# EasyEDA Pro project macro_fader.eprj

# Board macro_fader
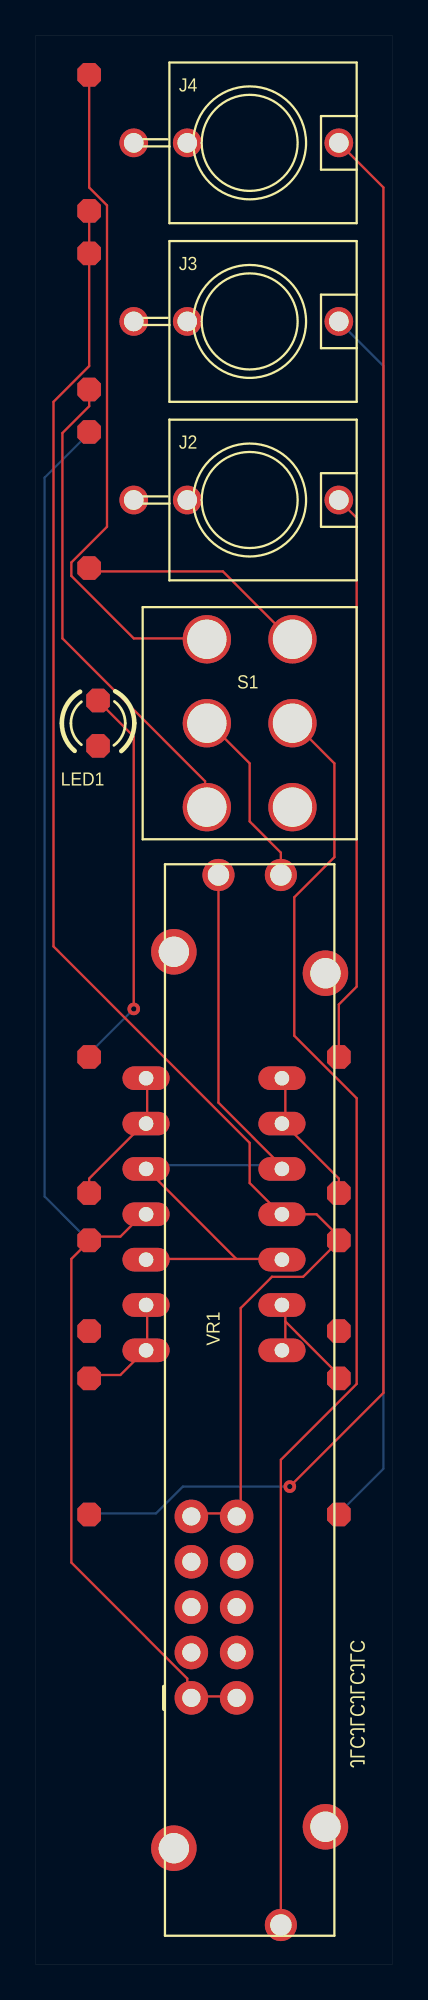
[diagram p0: board, top side]
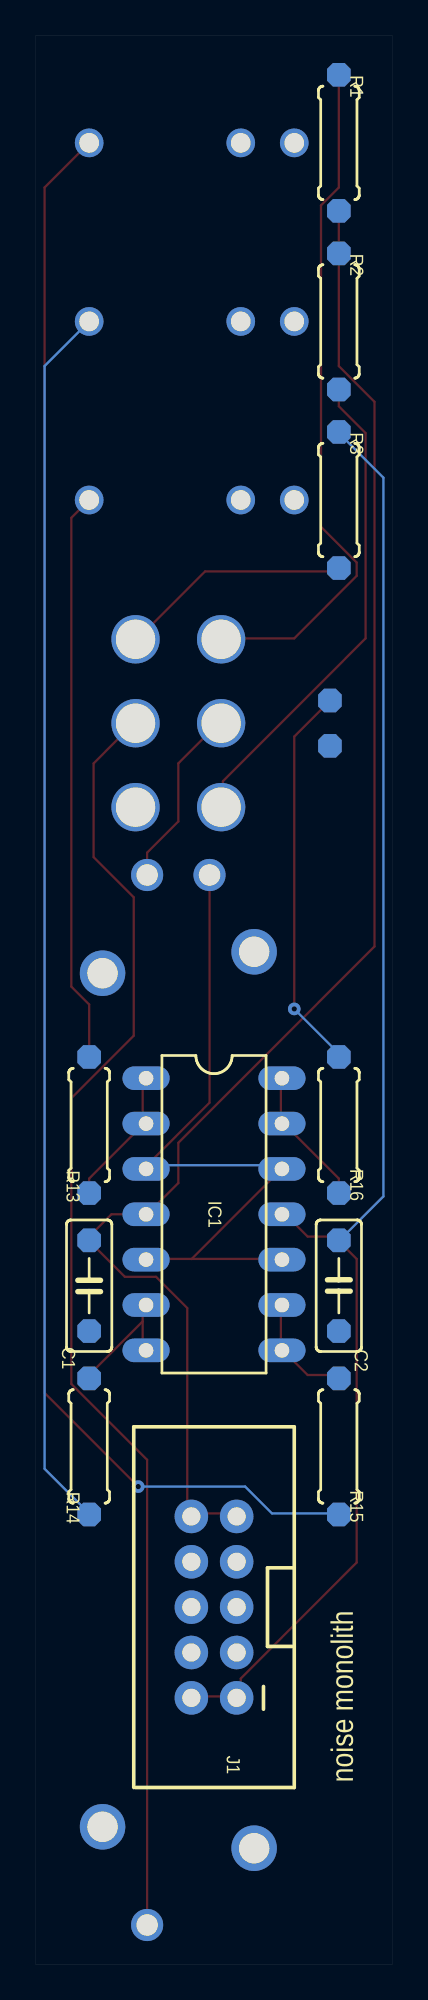
[diagram p1: board, bottom side, seen from below]

Outline 20 x 108 mm; copper layers: Top Layer, Bottom Layer. Coordinates in mm from the lower left corner of the outline.
Outline path: 0,108 0,0 20,0 20,108 0,108
Stack: Top Layer 0.035mm / Dielectric1 1.51mm FR4 er 4.5 / Bottom Layer 0.035mm

## Design rules (mm)
spacing safeClearance (default): track to track 0.127, other pairs 0 to 0.2
track width trackWidth (default): min 0.003, default 0.003, max 2.54
differential pair differentialPair (default): width min 0.127, default 0.254, max 2.54; gap min 0.152, default 0.152
via viaSize (default): diameter min 0, default 0, max 2.6; hole min 0, default 0, max 2
pour ie1 uses CopperRegion

## Placement (name value [footprint] x y rotation side)
C1  0.1uF  [C050-025X075]  17 38 270 bottom
C2  0.1uF  [C050-025X075]  3 38 90 bottom
IC1  TL074P  [DIL14]  10 42 270 bottom
J1  -  [2X5-SHROUDED]  10 20 0 bottom
J2  -  [WQP-PJ301M-12_JACK]  12 82 270 top
J3  -  [WQP-PJ301M-12_JACK]  12 92 270 top
J4  -  [WQP-PJ301M-12_JACK]  12 102 270 top
LED1  -  [A-1076_RED-GREEN-LED-3MM]  3.5 69.5 270 top
R1  7k  [0207/7]  3 102 90 bottom
R2  14k  [0207/7]  3 92 270 bottom
R3  7k  [0207/7]  3 82 270 bottom
R13  1k  [0207/7]  17 47 90 bottom
R14  1k  [0207/7]  17 29 270 bottom
R15  1k  [0207/7]  3 29 270 bottom
R16  220  [0207/7]  3 47 90 bottom
S1  -  [A-4568_MINITOGGLESWITCH_DPDT_ON-ON]  12 69.5 0 top
VR1  -  [F4505-N0SC2B10K]  12 61 270 top

## Footprints (pads in the part's own frame, mm; a bottom-side part is the same pattern mirrored in y, then rotated)
2X5-SHROUDED
  round 1.879 hole 1.016: 1(-1.27,5.08) 2(1.27,5.08) 3(-1.27,2.54) 4(1.27,2.54) 5(-1.27,0) 6(1.27,0) 7(-1.27,-2.54) 8(1.27,-2.54) 9(-1.27,-5.08) 10(1.27,-5.08)
0207/7
  custom 1.321x1.321 hole 0.813: 1(-3.81,0) 2(3.81,0)
A-1076_RED-GREEN-LED-3MM
  custom 1.321x1.321 hole 0.813: G(1.27,0) R(-1.27,0)
A-4568_MINITOGGLESWITCH_DPDT_ON-ON
  round 2.708 hole 2.2: 1(-2.4,4.7) 2(-2.4,0) 3(-2.4,-4.7) 4(2.4,4.7) 5(2.4,0) 6(2.4,-4.7)
C050-025X075
  custom 1.321x1.321 hole 0.813: 1(-2.54,0) 2(2.54,0)
DIL14
  oval 1.321x2.642 hole 0.813: 1(-7.62,-3.81) 2(-5.08,-3.81) 3(-2.54,-3.81) 4(0,-3.81) 5(2.54,-3.81) 6(5.08,-3.81) 7(7.62,-3.81) 8(7.62,3.81) 9(5.08,3.81) 10(2.54,3.81) 11(0,3.81) 12(-2.54,3.81) 13(-5.08,3.81) 14(-7.62,3.81)
F4505-N0SC2B10K
  round 1.8 hole 1.2: 1(0,1.75) 2(0,-1.75) 3(58.8,1.75)
  round 2.55 hole 1.7: MH1(5.5,4.25) MH2(4.3,-4.25) MH3(53.3,4.25) MH4(54.5,-4.25)
WQP-PJ301M-12_JACK
  round 1.608 hole 1.1: P$1(0,5) P$2(0,-3.5) P$3(0,-6.5)

## Nets
+12V: C1.1 IC1.4 J1.9 J1.10 R1.1 R2.1
-12V: C2.2 IC1.11 J1.1 J1.2 R3.1
GND: C1.2 C2.1 J1.3 J1.4 J1.5 J1.6 J1.7 J1.8 J2.P$3 J3.P$3 J4.P$3 LED1.G S1.6
FADER_1: IC1.3 IC1.5 IC1.10 IC1.12 VR1.2
N$1: S1.2 VR1.1
N$2: S1.5 VR1.3
N$3: R1.2 S1.1
N$4: IC1.1 IC1.2 R13.1
N$5: R2.2 S1.3
N$6: J2.P$1 R13.2
N$7: R3.2 S1.4
N$9: IC1.6 IC1.7 R14.1
N$10: J3.P$1 R14.2
N$11: IC1.8 IC1.9 R15.1
N$12: J4.P$1 R15.2
N$13: IC1.13 IC1.14 R16.1
N$14: LED1.R R16.2

Pads without a net: J2 P$2; J3 P$2; J4 P$2; VR1 MH1 MH2 MH3 MH4

## Via types
v1: diameter 0.707, hole 0.3, Top Layer to Bottom Layer, 2 vias

## Routing (per net, layer and track width the routed paths; a pad name or vN(x,y) marks a point on that pad's centre or on a via; arc(x,y) is an arc through that point)
+12V: length 88
  Top Layer w0.127: J1.9 8.75,25.25 11.25,25.25 J1.10 11.5,25.25 11.5,36.75 13.25,38.5 15,38.5 17,40.5 C1.1 17,40.75 15.75,42 IC1.4 13.75,42 12,43.75 12,46 1,57 1,87.5 3,89.5 R2.1 R1.1
-12V: length 82.9
  Top Layer w0.127: J1.2 11.25,15 8.75,15 J1.1 8.5,15 8.5,16 2,22.5 2,39.5 3,40.5 C2.2 3,40.75 4.75,40.75 6,42 IC1.11
  Bottom Layer w0.127: R3.1 3,85.75 0.5,83.25 0.5,43 3,40.5 C2.2
FADER_1: length 40.6
  Top Layer w0.127: IC1.12 6.25,44.5 11.25,39.5 ; IC1.5 13.75,39.5 11.25,39.5 ; IC1.10 6.25,39.5 11.25,39.5 ; VR1.2 10.25,48.25 13.75,44.75 IC1.3
  Bottom Layer w0.127: IC1.12 6.25,44.75 13.75,44.75 IC1.3
N$1: length 10.3
  Top Layer w0.127: VR1.1 13.75,62.25 12,64 12,67.25 9.75,69.5 S1.2
N$2: length 72.5
  Top Layer w0.127: VR1.3 13.75,28.25 18,32.5 18,48.5 14.5,52 14.5,59.75 16.75,62 16.75,67.25 14.5,69.5 S1.5
N$3: length 38.4
  Top Layer w0.127: R1.2 3,99.5 4,98.5 4,80.5 2,78.5 2,77.75 5.5,74.25 9.5,74.25 S1.1
N$4: length 8
  Top Layer w0.127: IC1.1 14,49.5 14,47.25 IC1.2 14,47 17,44 R13.1
N$5: length 27.3
  Top Layer w0.127: R2.2 3,87.25 1.5,85.75 1.5,74.25 9.5,66.25 9.5,65 S1.3
N$6: length 32
  Top Layer w0.127: J2.P$1 18,81 18,54.75 17,53.75 R13.2
N$7: length 13.2
  Top Layer w0.127: R3.2 3,78 10.5,78 14.25,74.25 S1.4
N$9: length 7.2
  Top Layer w0.127: 14,36 14,34.5 IC1.7 ; 14,36 14,36.75 IC1.6 ; 14,36 17,33 R14.1
N$10: length 68.9
  Bottom Layer w0.127: R14.2 17,25.25 19.5,27.75 19.5,89.5 J3.P$1
N$11: length 6.5
  Top Layer w0.127: R15.1 3,33 4.75,33 6,34.25 IC1.8 6.25,34.5 6.25,36.75 IC1.9
N$12: length 90.4
  Top Layer w0.127: J4.P$1 19.5,99.5 19.5,32 v1(14.25,26.75)
  Bottom Layer w0.127: v1(14.25,26.75) 8.25,26.75 6.75,25.25 3,25.25 R15.2
N$13: length 7.8
  Top Layer w0.127: R16.1 3,44 6,47 IC1.13 6.25,47.25 6.25,49.5 IC1.14
N$14: length 21.8
  Top Layer w0.127: LED1.R 3.5,70.75 5.5,68.75 v1(5.5,53.5)
  Bottom Layer w0.127: R16.2 3,51 v1(5.5,53.5)

## Copper pours and planes (outline as drawn; the poured copper is in the pictures)
GND on Bottom Layer: 1,1 19,1 19,107 1,107

## Text on the board
Bottom Silkscreen Layer: noise monolith
Top Silkscreen Layer: JLCJLCJLCJLC

# Board PCB2
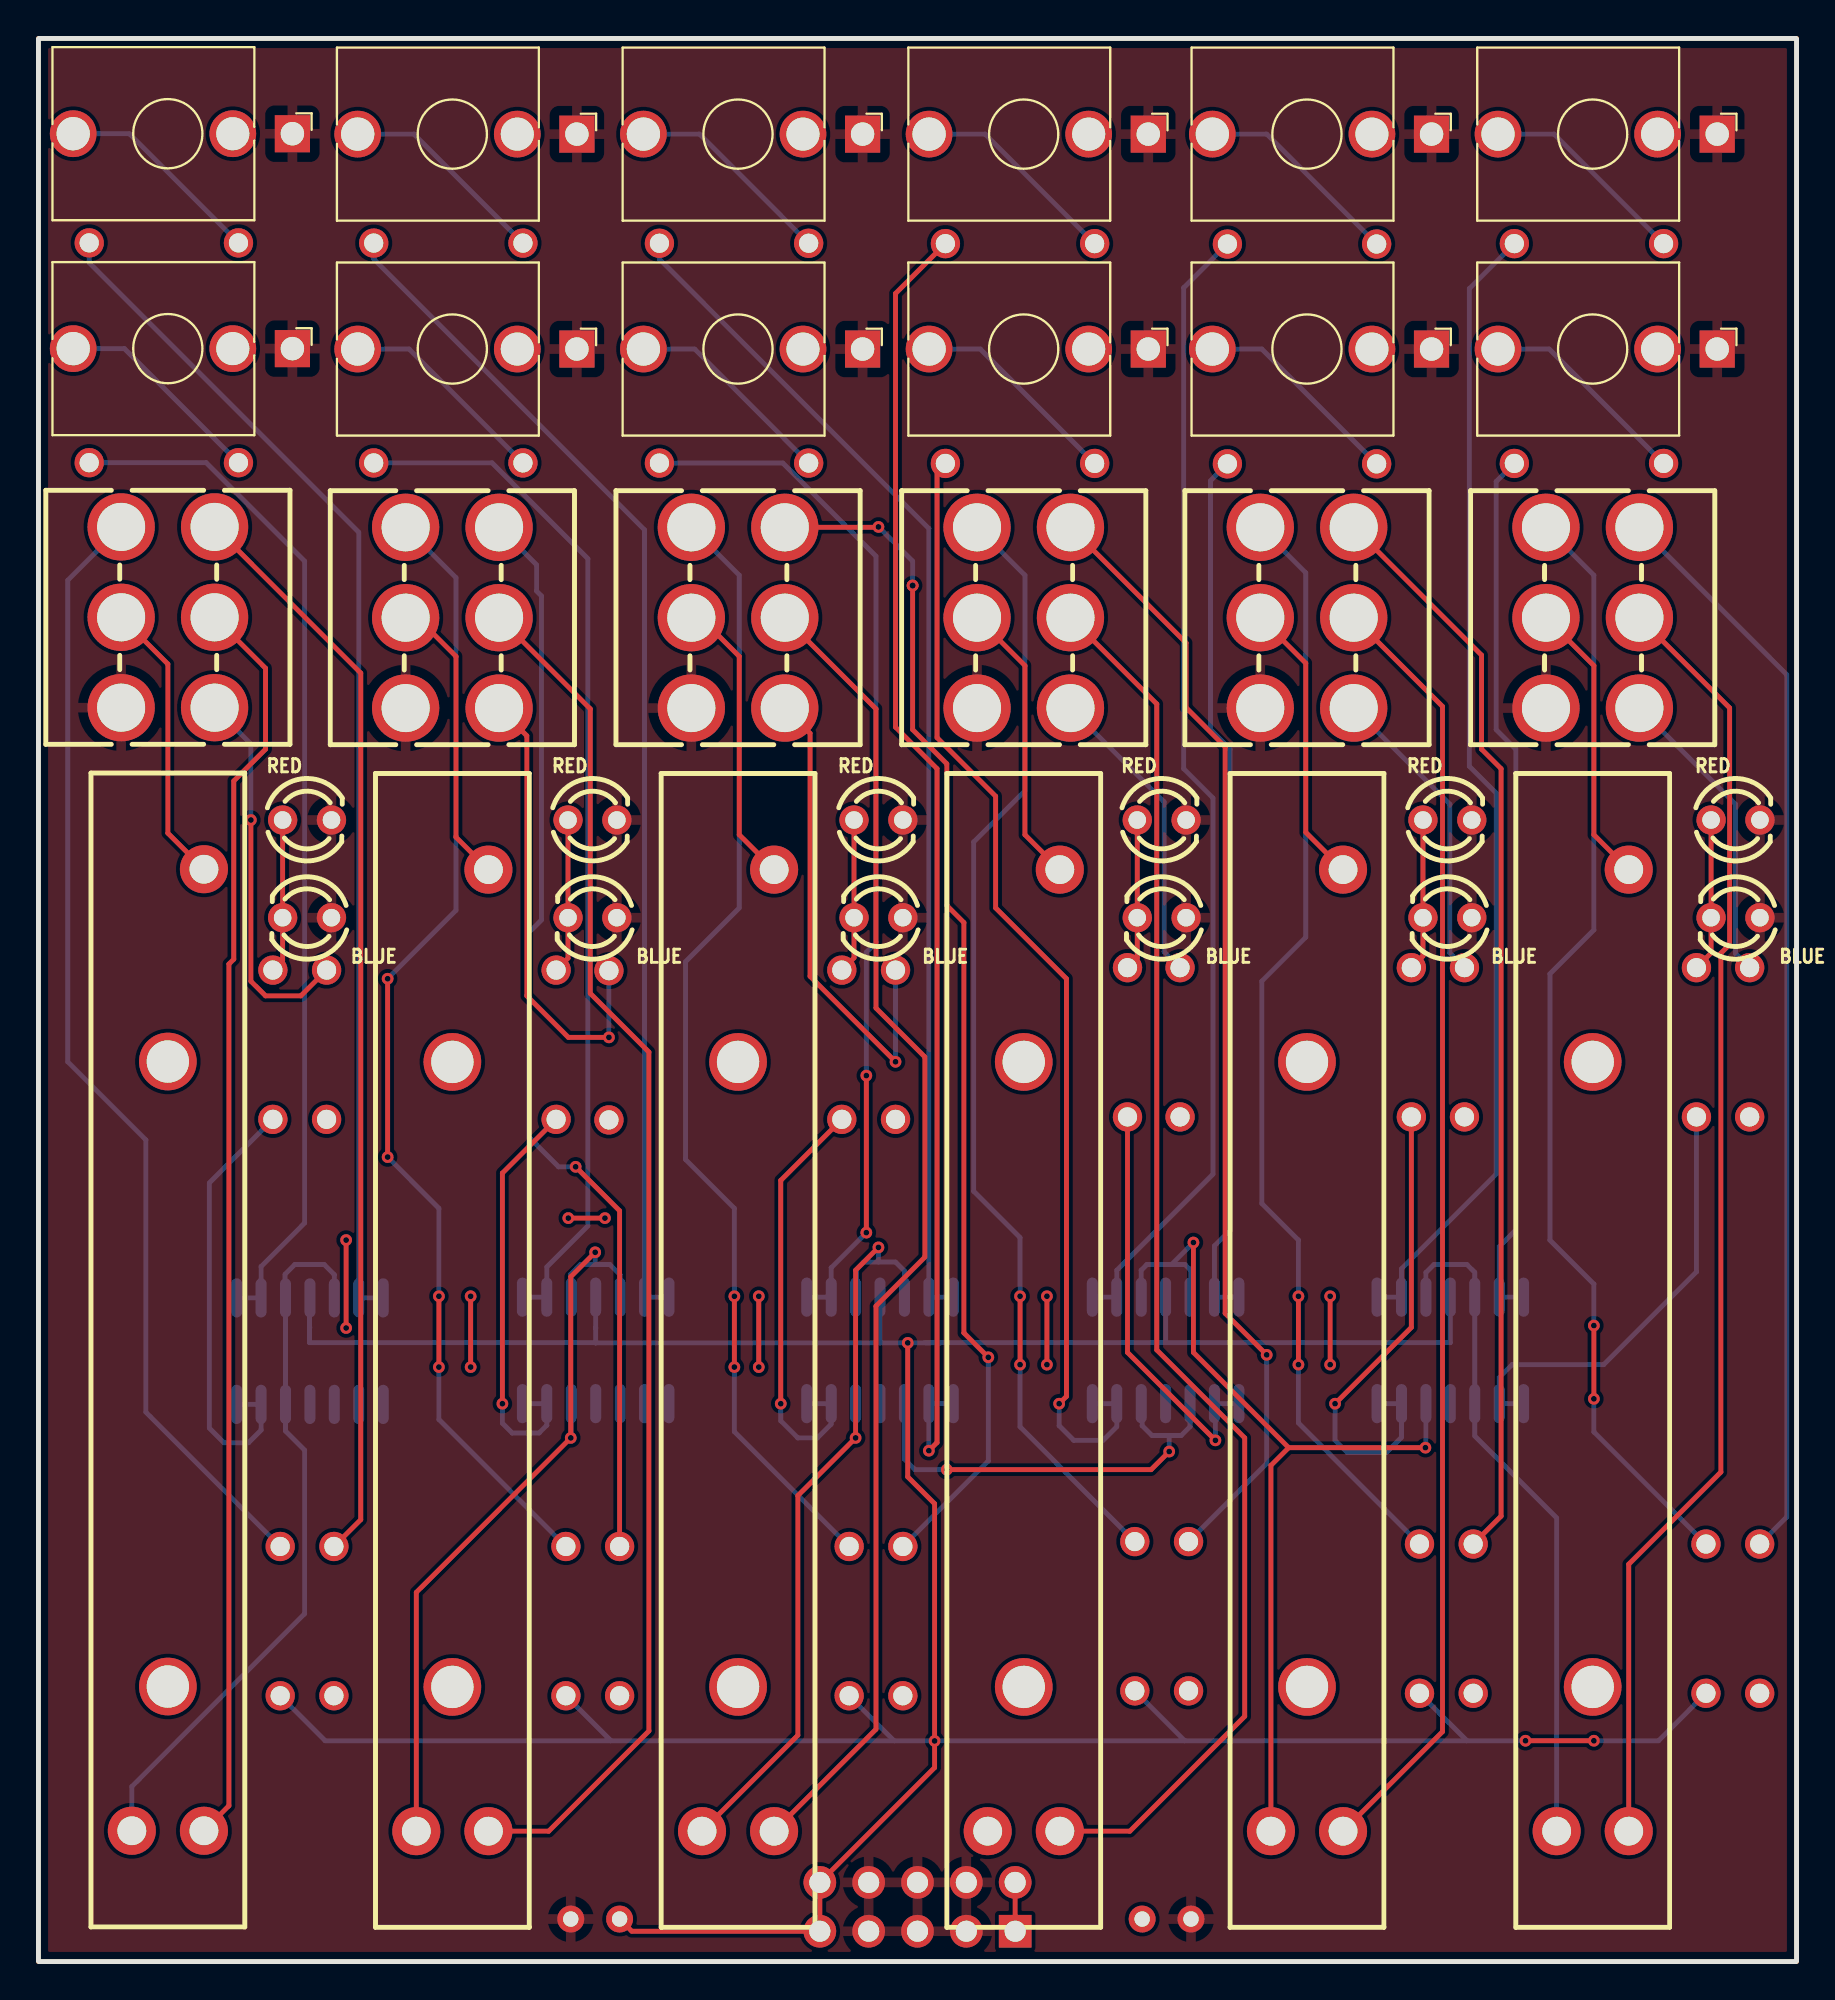
[diagram p2: board, top side]
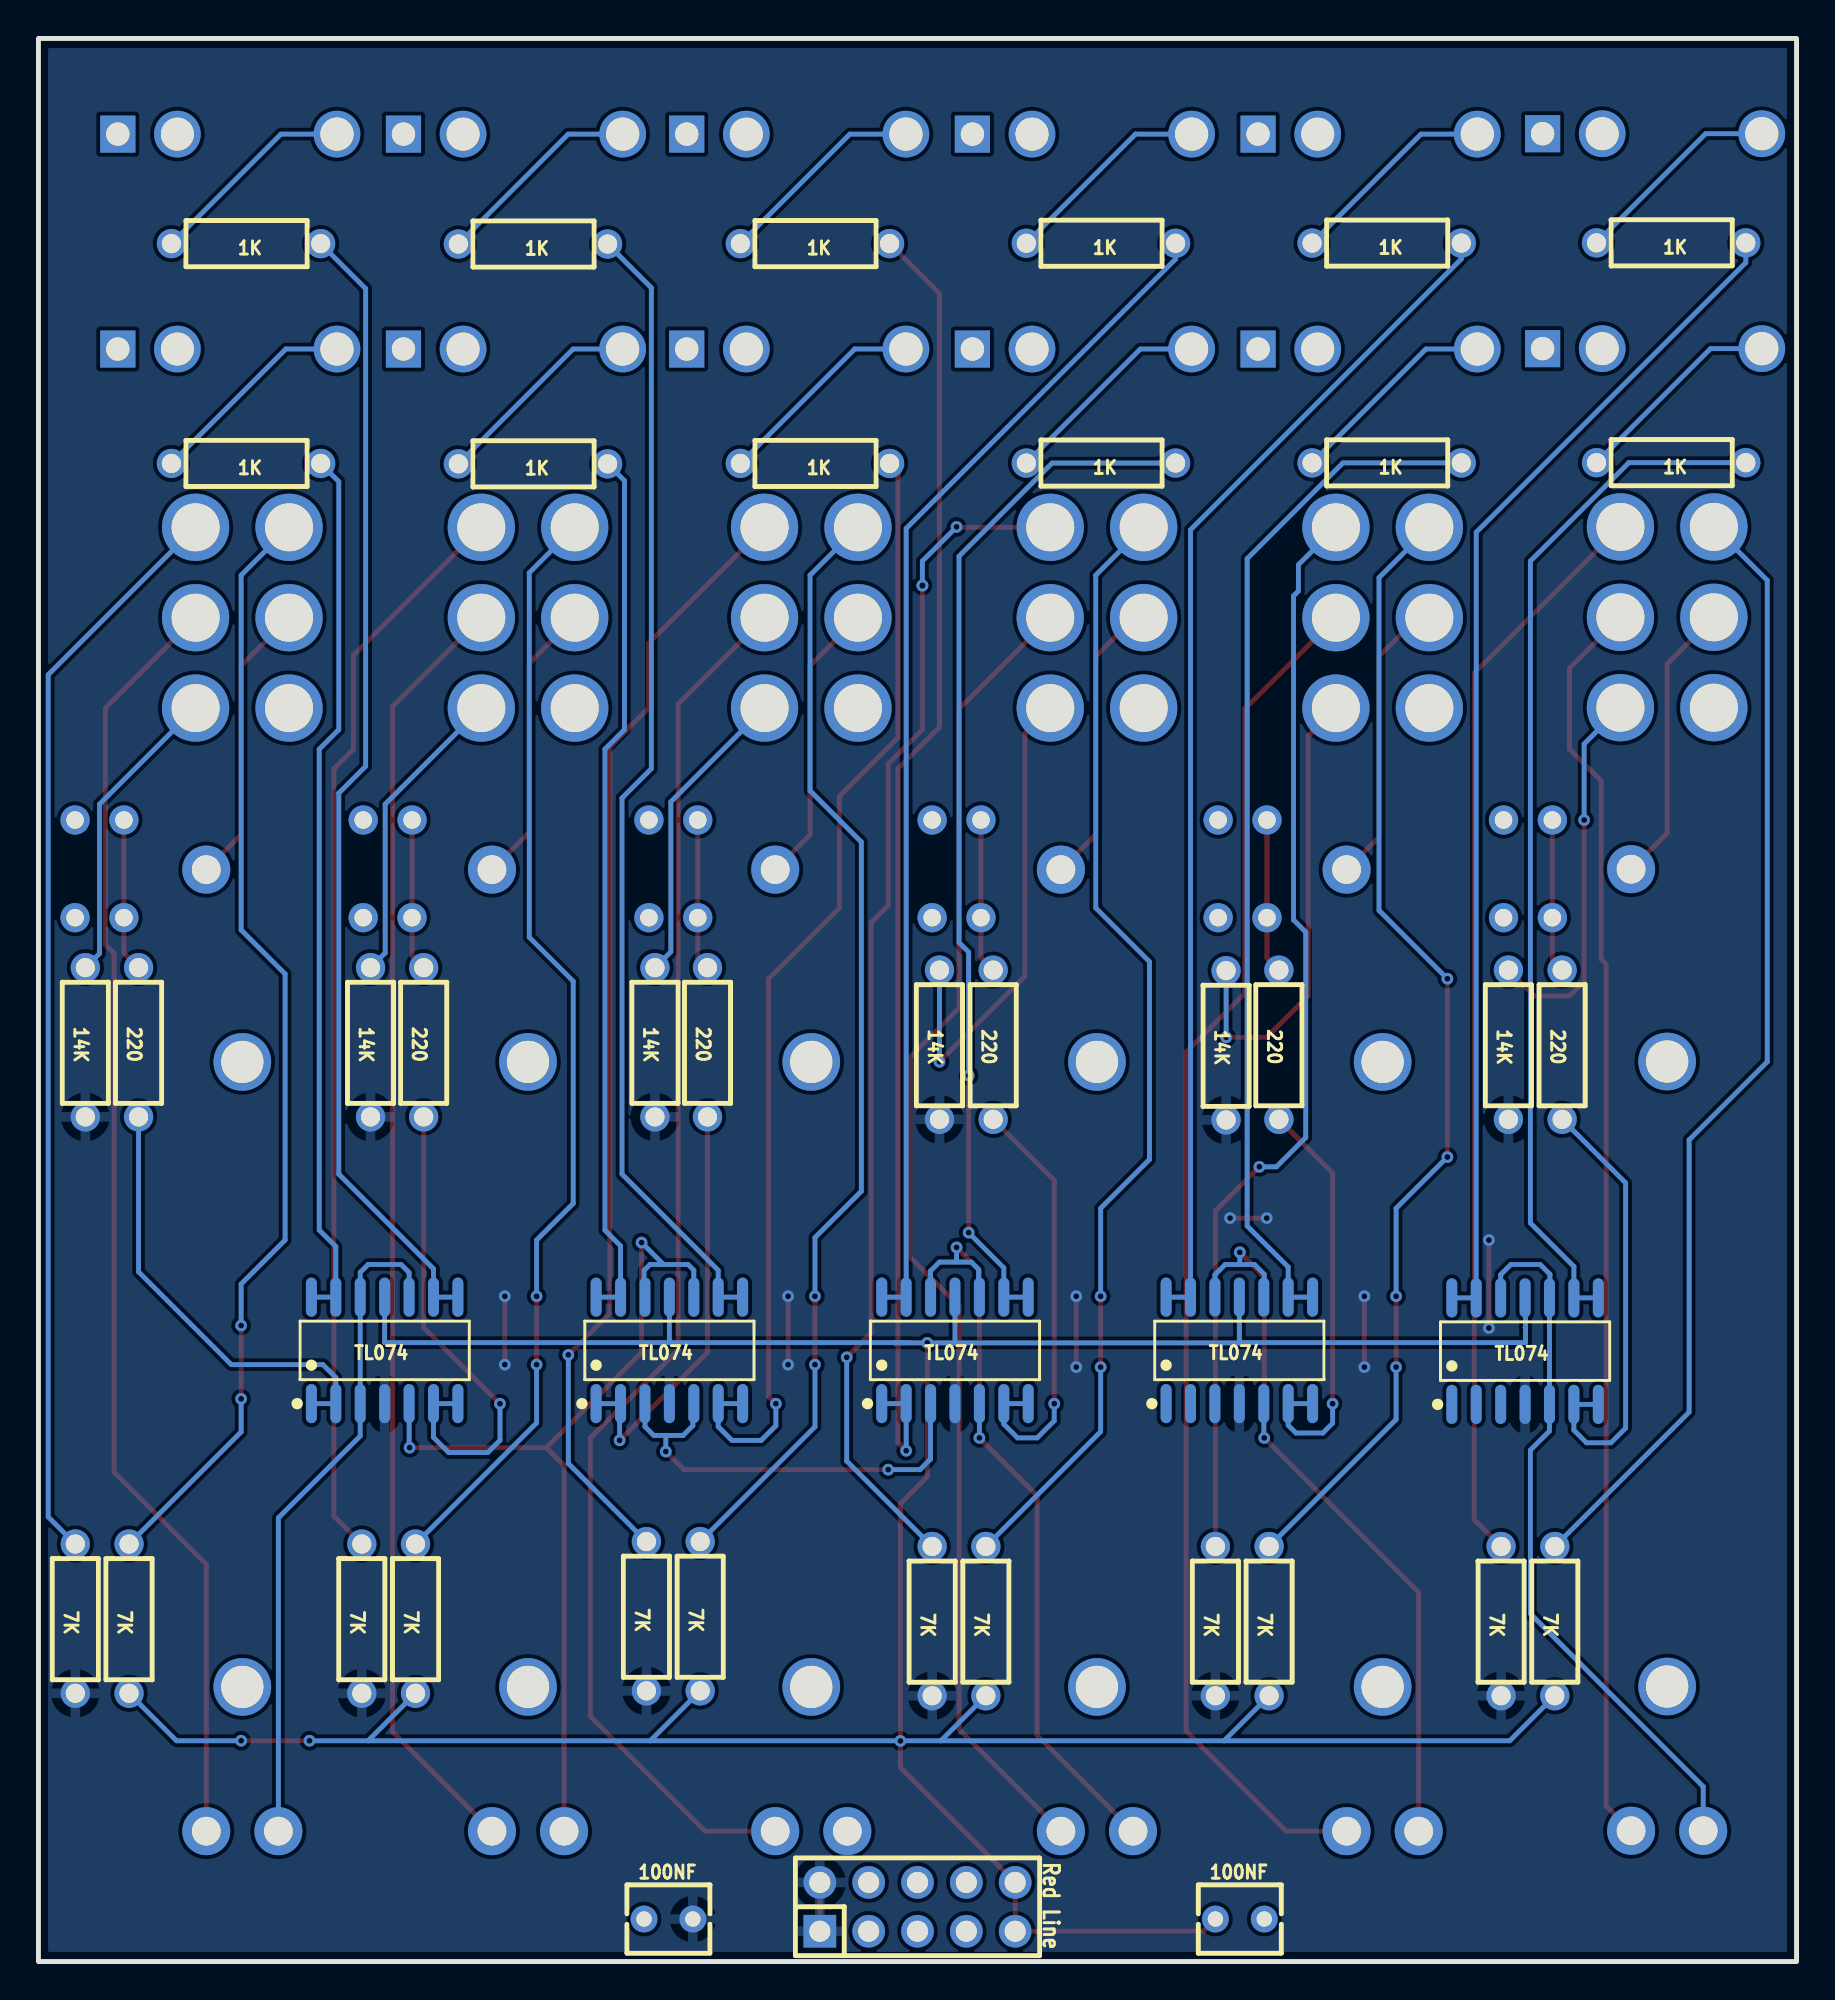
[diagram p3: board, bottom side, seen from below]

Outline 91.44 x 100 mm; copper layers: Top Layer, Bottom Layer. Coordinates in mm from the lower left corner of the outline.
Outline path: rectangle 0,100 91.44,0
Stack: Top Layer 0.035mm / Dielectric1 1.51mm FR4 er 4.5 / Bottom Layer 0.035mm

## Design rules (mm)
template: JLCPCB Capability(Two Layers Board)
spacing copperThickness1oz (default): track to track 0.102, other pairs 0.152 to 0.3
spacing copperThickness2oz: track to track 0.203, other pairs 0.152 to 0.3
track width copperThickness1oz (default): min 0.127, default 0.254, max 2.54
track width copperThickness2oz: min 0.203, default 0.254, max 2.54
differential pair differentialPair (default): width min 0.127, default 0.254, max 2.54; gap min 0.152, default 0.152
via viaSize (default): diameter min 0.5, default 0.61, max 10; hole min 0.3, default 0.305, max 6.3

## Placement (name value [footprint] x y rotation side)
1K  -  [Resistor_Small]  51.05 89.33 180 bottom
1K#2  -  [Resistor_Small]  51.05 77.9 180 bottom
1K#3  -  [Resistor_Small]  65.72 89.31 180 bottom
1K#4  -  [Resistor_Small]  65.72 77.88 180 bottom
1K#5  -  [Resistor_Small]  80.65 89.33 180 bottom
1K#6  -  [Resistor_Small]  80.65 77.9 180 bottom
1K#7  -  [Resistor_Small]  36.18 89.35 180 bottom
1K#8  -  [Resistor_Small]  36.18 77.92 180 bottom
1K#9  -  [Resistor_Small]  21.32 89.36 180 bottom
1K#10  -  [Resistor_Small]  21.32 77.93 180 bottom
1K#11  -  [Resistor_Small]  6.52 89.37 180 bottom
1K#12  -  [Resistor_Small]  6.52 77.94 180 bottom
7K  -  [Resistor_Small]  86.73 17.83 270 bottom
7K#2  -  [Resistor_Small]  71.83 17.83 270 bottom
7K#3  -  [Resistor_Small]  74.62 17.83 270 bottom
7K#4  -  [Resistor_Small]  57.02 17.96 270 bottom
7K#5  -  [Resistor_Small]  59.82 17.96 270 bottom
7K#6  -  [Resistor_Small]  42.16 17.7 270 bottom
7K#7  -  [Resistor_Small]  44.96 17.7 270 bottom
7K#8  -  [Resistor_Small]  27.43 17.7 270 bottom
7K#9  -  [Resistor_Small]  30.23 17.7 270 bottom
7K#10  -  [Resistor_Small]  12.57 17.7 270 bottom
7K#11  -  [Resistor_Small]  15.37 17.7 270 bottom
7K#12  -  [Resistor_Small]  89.52 17.83 270 bottom
14K  -  [Resistor_Small]  74.17 47.8 270 bottom
14K#2  -  [Resistor_Small]  89 47.8 270 bottom
14K#3  -  [Resistor_Small]  59.38 47.8 270 bottom
14K#4  -  [Resistor_Small]  44.58 47.68 270 bottom
14K#5  -  [Resistor_Small]  29.67 47.65 270 bottom
14K#6  -  [Resistor_Small]  14.99 47.68 270 bottom
100NF  -  [CAP-TH_L4.2-W3.5-P2.54-D0.5]  58.67 2.21 180 bottom
100NF#2  -  [CAP-TH_L4.2-W3.5-P2.54-D0.5]  28.96 2.21 180 bottom
220  -  [Resistor_Small]  86.23 47.8 270 bottom
220#2  -  [Resistor_Small]  71.41 47.8 270 bottom
220#3  -  [Resistor_Small]  56.64 47.8 270 bottom
220#4  -  [Resistor_Small]  41.78 47.68 270 bottom
220#5  -  [Resistor_Small]  26.92 47.68 270 bottom
220#6  -  [Resistor_Small]  12.19 47.68 270 bottom
BLUE  -  [LED-TH_BD3.0-P2.54-FD]  13.97 54.28 180 top
BLUE#2  -  [LED-TH_BD3.0-P2.54-FD]  28.81 54.28 180 top
BLUE#3  -  [LED-TH_BD3.0-P2.54-FD]  43.69 54.28 180 top
BLUE#4  -  [LED-TH_BD3.0-P2.54-FD]  58.42 54.28 180 top
BLUE#5  -  [LED-TH_BD3.0-P2.54-FD]  73.28 54.28 180 top
BLUE#6  -  [LED-TH_BD3.0-P2.54-FD]  88.26 54.28 180 top
J2  -  [benjiaomodular:AudioJack_3.5mm]  87.31 83.85 270 top
J2#2  -  [benjiaomodular:AudioJack_3.5mm]  87.31 95.03 270 top
J2#3  -  [benjiaomodular:AudioJack_3.5mm]  13.21 95.05 270 top
J2#4  -  [benjiaomodular:AudioJack_3.5mm]  13.21 83.87 270 top
J2#5  -  [benjiaomodular:AudioJack_3.5mm]  28 83.85 270 top
J2#6  -  [benjiaomodular:AudioJack_3.5mm]  28 95.03 270 top
J2#7  -  [benjiaomodular:AudioJack_3.5mm]  42.86 83.85 270 top
J2#8  -  [benjiaomodular:AudioJack_3.5mm]  42.86 95.03 270 top
J2#9  -  [benjiaomodular:AudioJack_3.5mm]  57.72 83.85 270 top
J2#10  -  [benjiaomodular:AudioJack_3.5mm]  57.72 95.03 270 top
J2#11  -  [benjiaomodular:AudioJack_3.5mm]  72.46 83.85 270 top
J2#12  -  [benjiaomodular:AudioJack_3.5mm]  72.46 95.03 270 top
RED  -  [LED-TH_BD3.0-P2.54-FD]  13.97 59.36 0 top
RED#2  -  [LED-TH_BD3.0-P2.54-FD]  28.81 59.36 0 top
RED#3  -  [LED-TH_BD3.0-P2.54-FD]  43.69 59.36 0 top
RED#4  -  [LED-TH_BD3.0-P2.54-FD]  58.42 59.36 0 top
RED#5  -  [LED-TH_BD3.0-P2.54-FD]  73.28 59.36 0 top
RED#6  -  [LED-TH_BD3.0-P2.54-FD]  88.26 59.36 0 top
SW1  -  [SW-TH_6P-P4.70_MT-0-202-A101-M200-RS-PJ]  80.84 69.88 0 top
SW1#2  -  [SW-TH_6P-P4.70_MT-0-202-A101-M200-RS-PJ]  6.73 69.9 0 top
SW1#3  -  [SW-TH_6P-P4.70_MT-0-202-A101-M200-RS-PJ]  21.53 69.88 0 top
SW1#4  -  [SW-TH_6P-P4.70_MT-0-202-A101-M200-RS-PJ]  36.39 69.88 0 top
SW1#5  -  [SW-TH_6P-P4.70_MT-0-202-A101-M200-RS-PJ]  51.25 69.88 0 top
SW1#6  -  [SW-TH_6P-P4.70_MT-0-202-A101-M200-RS-PJ]  65.98 69.88 0 top
TL074  -  [SOIC-14_L8.7-W3.9-P1.27-LS6.0-BL]  73.43 31.78 180 bottom
TL074#2  -  [SOIC-14_L8.7-W3.9-P1.27-LS6.0-BL]  58.62 31.78 180 bottom
TL074#3  -  [SOIC-14_L8.7-W3.9-P1.27-LS6.0-BL]  28.98 31.78 180 bottom
TL074#4  -  [SOIC-14_L8.7-W3.9-P1.27-LS6.0-BL]  14.12 31.74 180 bottom
TL074#5  -  [SOIC-14_L8.7-W3.9-P1.27-LS6.0-BL]  43.77 31.78 180 bottom
U1  ZX-PZ2.54-2-5PZZ  [HDR-TH_10P-P2.54-V-M-R2-C5-S2.54]  45.72 2.84 180 bottom
U2  -  [RES-ADJ-TH_RS45111A900F]  80.84 31.78 90 top
U2#2  -  [RES-ADJ-TH_RS45111A900F]  21.53 31.78 90 top
U2#3  -  [RES-ADJ-TH_RS45111A900F]  6.73 31.8 90 top
U2#4  -  [RES-ADJ-TH_RS45111A900F]  36.39 31.78 90 top
U2#5  -  [RES-ADJ-TH_RS45111A900F]  51.25 31.78 90 top
U2#6  -  [RES-ADJ-TH_RS45111A900F]  65.98 31.78 90 top

## Footprints (pads in the part's own frame, mm; a bottom-side part is the same pattern mirrored in y, then rotated)
benjiaomodular:AudioJack_3.5mm
  rect 1.93x1.83 hole 1.22: S(0,0)
  round 2.43 hole 1.73: T(0,-11.4)
  round 2.43 hole 1.72: TN(0,-3.1)
CAP-TH_L4.2-W3.5-P2.54-D0.5
  round 1.4 hole 0.8: 1(-1.27,0) 2(1.27,0)
HDR-TH_10P-P2.54-V-M-R2-C5-S2.54
  rect 1.7x1.7 hole 1.1: 1(-5.08,-1.27)
  round 1.7 hole 1.1: 2(-5.08,1.27) 3(-2.54,-1.27) 4(-2.54,1.27) 5(0,-1.27) 6(0,1.27) 7(2.54,-1.27) 8(2.54,1.27) 9(5.08,-1.27) 10(5.08,1.27)
LED-TH_BD3.0-P2.54-FD
  round 1.524 hole 0.914: 1(-1.27,0) 2(1.27,0)
RES-ADJ-TH_RS45111A900F
  round 2.5 hole 1.5: 1(-25,-1.875) 2(-25,1.875) 3(25,-1.875)
  round 3 hole 2.2: 4(-17.5,0) 5(15,0)
Resistor_Small
  round 1.524 hole 1: 1(-3.88,0) 2(3.882,0)
SOIC-14_L8.7-W3.9-P1.27-LS6.0-BL
  oval 0.574x2.038 smd: 1(-3.81,-2.769) 2(-2.54,-2.769) 3(-1.27,-2.769) 4(0,-2.769) 5(1.27,-2.769) 6(2.54,-2.769) 7(3.81,-2.769) 8(3.81,2.769) 9(2.54,2.769) 10(1.27,2.769) 11(0,2.769) 12(-1.27,2.769) 13(-2.54,2.769) 14(-3.81,2.769)
SW-TH_6P-P4.70_MT-0-202-A101-M200-RS-PJ
  round 3.5 hole 2.5: 1(-2.43,-4.7) 2(-2.43,0) 3(-2.43,4.7) 4(2.43,-4.7) 5(2.43,0) 6(2.43,4.7)

## Nets
GND: 100NF.1 100NF#2.2 BLUE.1 BLUE#2.1 BLUE#3.1 BLUE#4.1 BLUE#5.1 BLUE#6.1 J2.S J2#2.S J2#3.S J2#4.S J2#5.S J2#6.S J2#7.S J2#8.S J2#9.S J2#10.S J2#11.S J2#12.S RED.2 RED#2.2 RED#3.2 RED#4.2 RED#5.2 RED#6.2 SW1.1 SW1#2.1 SW1#3.1 SW1#4.1 SW1#5.1 SW1#6.1 U1.3 U1.4 U1.5 U1.6 U1.7 U1.8
+12: 7K#3.2 7K#5.2 7K#7.2 7K#9.2 7K#11.2 7K#12.2 14K.2 14K#2.2 14K#3.2 14K#4.2 14K#5.2 14K#6.2 100NF.2 TL074.4 TL074#2.4 TL074#3.4 TL074#4.4 TL074#5.4 U1.1 U1.2
-12: 7K.2 7K#2.2 7K#4.2 7K#6.2 7K#8.2 7K#10.2 100NF#2.1 TL074.11 TL074#2.11 TL074#3.11 TL074#4.11 TL074#5.11 U1.9 U1.10

Pads without a net: 1K 1 2; 1K#2 1 2; 1K#3 1 2; 1K#4 1 2; 1K#5 1 2; 1K#6 1 2; 1K#7 1 2; 1K#8 1 2; 1K#9 1 2; 1K#10 1 2; 1K#11 1 2; 1K#12 1 2; 7K 1; 7K#2 1; 7K#3 1; 7K#4 1; 7K#5 1; 7K#6 1; 7K#7 1; 7K#8 1; 7K#9 1; 7K#10 1; 7K#11 1; 7K#12 1; 14K 1; 14K#2 1; 14K#3 1; 14K#4 1; 14K#5 1; 14K#6 1; 220 1 2; 220#2 1 2; 220#3 1 2; 220#4 1 2; 220#5 1 2; 220#6 1 2; BLUE 2; BLUE#2 2; BLUE#3 2; BLUE#4 2; BLUE#5 2; BLUE#6 2; J2 T TN; J2#2 T TN; J2#3 T TN; J2#4 T TN; J2#5 T TN; J2#6 T TN; J2#7 T TN; J2#8 T TN; J2#9 T TN; J2#10 T TN; J2#11 T TN; J2#12 T TN; RED 1; RED#2 1; RED#3 1; RED#4 1; RED#5 1; RED#6 1; SW1 2 3 4 5 6; SW1#2 2 3 4 5 6; SW1#3 2 3 4 5 6; SW1#4 2 3 4 5 6; SW1#5 2 3 4 5 6; SW1#6 2 3 4 5 6; TL074 1 2 3 5 6 7 8 9 10 12 13 14; TL074#2 1 2 3 5 6 7 8 9 10 12 13 14; TL074#3 1 2 3 5 6 7 8 9 10 12 13 14; TL074#4 1 2 3 5 6 7 8 9 10 12 13 14; TL074#5 1 2 3 5 6 7 8 9 10 12 13 14; U2 1 2 3 4 5; U2#2 1 2 3 4 5; U2#3 1 2 3 4 5; U2#4 1 2 3 4 5; U2#5 1 2 3 4 5; U2#6 1 2 3 4 5

## Via types
v1: diameter 0.61, hole 0.305, Top Layer to Bottom Layer, 53 vias

## Routing (per net, layer and track width the routed paths; a pad name or vN(x,y) marks a point on that pad's centre or on a via; arc(x,y) is an arc through that point)
(no net): length 2554.1
  Top Layer w0.254: v1(58.81,26.52) 57.87,25.58 v1(47.24,25.58) ; SW1#5.6 59.69,68.57 59.69,65.2 61.72,63.17 61.72,33.71 v1(63.88,31.55) ; SW1#6.2 65.91,67.52 65.91,58.72 U2#6.3 ; U2#5.1 56.77,6.78 62.74,12.75 62.74,27.23 58.17,31.8 58.17,65.39 SW1#5.5 ; v1(67.44,29.01) 71.41,32.97 220#2.2 ; 65.02,26.72 60.07,31.67 v1(60.07,37.39) ; 65.02,26.72 v1(72.14,26.72) ; 65.02,26.72 64.1,25.8 U2#6.2 ; 56.63,51.68 57.15,52.2 BLUE#4.2 RED#4.1 ; 7K#3.1 76.07,23.16 76.07,62.03 75.06,63.04 75.06,67.93 SW1#6.6 ; U2#4.2 39.5,11.77 39.5,24.23 v1(42.5,27.23) 42.5,35.95 v1(43.69,37.14) ; SW1#4.2 34.44,69.88 36.45,67.87 36.45,58.59 U2#4.3 ; SW1#3.2 19.71,69.88 21.72,67.87 21.72,58.47 U2#2.3 ; U2#4.1 43.56,12.08 43.56,34.09 46.1,36.63 46.1,47.04 43.56,49.58 43.56,65.14 SW1#4.5 ; 220.1 87,52.44 87,59.36 ; 220#2.1 72.01,52.29 BLUE#5.2 RED#5.1 ; 1K#2.2 46.74,77.47 46.74,63.64 49.78,60.59 49.78,54.79 53.47,51.11 53.47,29.39 v1(53.09,29.01) ; 27.54,59.36 27.54,52.17 220#5.1 ; 220#6.1 12.7,52.06 BLUE.2 RED.1 ; U2.3 80.9,58.59 80.9,67.39 78.41,69.88 ; v1(36.19,34.59) v1(36.19,30.91) ; SW1#6.5 73.03,65.26 73.03,11.95 U2#6.1 ; 220#4.2 38.61,40.62 v1(38.61,29.01) ; SW1#3.4 25.4,63.74 25.4,50.22 27.56,48.06 v1(29.67,48.06) ; 14K#6.1 13.65,50.22 11.81,50.22 11.05,50.98 v1(11.05,59.36) ; v1(44.58,46.79) 40.13,51.23 40.13,63.87 SW1#4.4 ; U2#3.3 6.73,58.68 6.73,67.47 SW1#2.2 ; v1(45.47,71.55) 45.47,64.06 47.24,62.28 47.24,54.92 48.13,54.03 48.13,32.69 v1(49.4,31.42) ; v1(61.21,27.1) 56.64,31.67 220#3.2 ; v1(46.31,26.56) 46.74,26.99 46.74,62.03 44.58,64.19 44.58,86.74 1K.2 ; SW1#5.2 51.31,67.39 51.31,58.59 U2#5.3 ; v1(20.83,30.91) v1(20.83,34.59) ; v1(18.16,41.83) v1(18.16,51.11) ; U2.1 82.71,20.66 87.5,25.45 87.5,52.43 87.96,52.89 87.96,65.19 SW1.5 ; 7K#9.1 30.23,39.04 v1(27.94,41.33) ; U2#2.2 19.65,19.2 v1(27.69,27.23) 27.69,35.61 v1(28.96,36.88) ; RED#3.1 BLUE#3.2 42.42,52.19 220#4.1 ; v1(24.13,29.01) 24.13,41 220#5.2 ; SW1#4.6 43.67,74.58 v1(43.69,74.6) ; v1(80.9,29.26) v1(80.9,33.07) ; v1(65.53,31.04) v1(65.53,34.59) ; SW1#3.5 28.7,65.14 28.7,50.34 31.75,47.3 31.75,11.99 26.54,6.78 U2#2.1 ; 7K#11.1 16.76,22.98 16.76,67 SW1#2.6 ; SW1#2.5 11.81,67.25 11.81,63.04 10.16,61.39 10.16,52.12 9.91,51.87 9.91,8.1 U2#3.1 ; v1(51.05,34.59) v1(51.05,31.04) ; v1(43.06,37.9) v1(43.06,46.07)
  Bottom Layer w0.254: 220#6.2 8.89,40.49 8.89,27.74 9.65,26.97 10.92,26.97 11.58,27.63 TL074#4.6 TL074#4.7 ; v1(67.44,29.01) 67.44,27.1 68.07,26.47 70.1,26.47 70.89,27.26 TL074.6 TL074.7 ; v1(44.58,46.79) 14K#4.1 ; TL074#5.7 TL074#5.6 41.23,27.95 40.51,27.23 39.5,27.23 38.61,28.12 v1(38.61,29.01) ; 1K#4.2 60.96,77 60.96,64.06 61.98,63.04 61.98,38.02 61.16,37.21 61.16,34.55 62.43,34.55 ; SW1#3.6 25.91,72.63 25.91,71.27 26.16,71.01 26.16,54.16 25.53,53.53 25.53,42.85 27.05,41.33 v1(27.94,41.33) ; v1(72.14,26.72) 72.16,26.75 TL074.5 ; v1(61.21,27.1) 61.21,28.96 TL074#2.2 TL074#2.1 ; 14K.1 73.41,52.44 73.41,60.18 SW1#6.4 ; 7K.1 80.9,27.54 v1(80.9,29.26) ; 7K#10.1 5.59,28.57 5.59,42.72 1.52,46.79 1.52,71.82 SW1#2.3 ; v1(46.31,26.56) TL074#5.2 TL074#5.1 ; v1(36.19,34.59) 36.19,39.17 33.66,41.71 33.66,51.99 36.45,54.79 36.45,72.09 SW1#4.3 ; v1(43.69,37.14) 43.69,36.37 ; 1K#9.1 19.53,95.03 J2#6.T ; J2#12.T 63.88,95.03 1K#3.1 ; 1K#12.2 8.72,77.94 13.84,72.82 13.84,38.41 11.58,36.14 TL074#4.9 TL074#4.8 ; 69.62,34.55 70.89,34.55 70.89,36.02 75.82,40.94 75.82,60.76 74.42,62.15 74.42,86.99 1K#5.2 ; SW1#5.3 51.31,72.09 51.31,60.88 48.64,58.22 48.64,40.06 51.05,37.64 v1(51.05,34.59) ; J2#8.T 34.38,95.03 1K#7.1 ; TL074#4.14 TL074#4.13 16.66,74.32 2.64,88.34 1K#11.2 ; SW1.6 90.93,66.92 90.93,23.12 7K#12.1 ; 1K#12.1 4.47,83.87 J2#4.T ; v1(43.06,46.07) 43.06,52.49 43.56,52.99 43.56,73.08 38.72,77.92 1K#8.2 ; 1K#4.1 63.63,83.85 J2#11.T ; 1K#6.1 78.58,83.85 J2.T ; 1K#8.1 34.13,83.85 J2#7.T ; J2#10.T 49.24,95.03 1K.1 ; TL074#3.8 TL074#3.9 26.44,36.12 28.57,38.25 28.57,72.95 23.59,77.93 1K#10.2 ; 1K#11.1 4.73,95.05 J2#3.T ; 7K#6.1 36.19,27.55 v1(36.19,30.91) ; SW1#3.3 21.72,71.96 21.72,54.66 v1(18.16,51.11) ; 58.93,36.25 59.63,36.25 59.94,35.93 59.94,34.6 59.89,34.55 ; 58.93,36.25 57.65,36.25 57.35,35.95 57.35,34.55 ; 58.93,36.25 v1(60.07,37.39) ; TL074#2.5 57.4,28.96 57.4,27.86 57.91,27.36 59.44,27.36 59.89,27.81 TL074#2.3 ; TL074.1 TL074.2 75.97,30.37 76.65,31.04 81.41,31.04 86.23,35.86 220.2 ; 28.96,36.25 28.96,36.25 v1(28.96,36.88) ; 28.96,36.25 29.72,36.25 30.25,35.71 TL074#3.12 ; 28.96,36.25 28.19,36.25 27.69,35.74 27.69,34.57 TL074#3.10 ; 78.41,74.58 80.9,72.09 80.9,53.64 78.61,51.36 78.61,37.52 80.9,35.23 v1(80.9,33.07) ; v1(20.83,30.91) 20.83,28.19 7K#8.1 ; v1(18.16,41.83) 20.83,39.17 v1(20.83,34.59) ; TL074#5.14 TL074#5.13 46.31,74.52 32.3,88.53 1K#7.2 ; TL074#5.5 v1(42.5,27.23) ; J2#2.T 78.83,95.03 1K#5.1 ; TL074#2.7 TL074#2.6 56.08,27.81 55.37,27.1 53.85,27.1 53.09,27.86 v1(53.09,29.01) ; TL074#5.10 42.54,34.59 42.54,35.99 42.93,36.37 44.58,36.37 45.04,35.91 TL074#5.12 ; 14K#3.1 58.55,52.51 58.55,60.31 SW1#5.4 ; v1(65.53,34.59) 65.53,37.52 63.63,39.42 63.63,50.98 65.91,53.26 65.91,72.22 SW1#6.3 ; TL074#3.14 TL074#3.13 31.52,74.45 17.44,88.53 1K#9.2 ; 1K#10.1 19.28,83.85 J2#5.T ; U2#3.2 4.86,9.1 13.84,18.09 13.84,26.59 12.85,27.59 TL074#4.5 TL074#4.10 12.83,34.53 12.83,35.74 13.33,36.25 14.86,36.25 15.39,35.72 TL074#4.12 ; 7K#2.1 65.53,28.01 v1(65.53,31.04) ; v1(24.13,29.01) 24.13,27.99 24.64,27.48 26.03,27.48 26.44,27.89 TL074#3.6 TL074#3.7 ; SW1.4 88.26,60.18 88.26,52.42 14K#2.1 ; 1K#2.1 48.99,83.85 J2#9.T ; 72.16,34.55 72.16,35.83 72.58,36.25 74.29,36.25 74.7,35.84 TL074.3 74.7,27.33 78.96,23.07 U2.2 ; v1(43.69,74.6) 45.47,72.82 v1(45.47,71.55) ; v1(11.05,59.36) 11.05,63.31 SW1#2.4 ; TL074#5.8 TL074#5.9 41.23,36.07 v1(43.06,37.9) ; 7K#4.1 51.05,27.81 v1(51.05,31.04) ; v1(27.69,27.23) 27.71,27.25 TL074#3.5 ; v1(63.88,31.55) 63.88,25.9 7K#5.1 ; 1K#3.2 59.56,87.04 59.56,62.03 61.09,60.5 61.09,40.94 56.08,35.94 56.08,34.55 54.81,34.55 ; 7K#7.1 49.4,26.03 v1(49.4,31.42) ; 14K#5.1 v1(29.67,48.06) ; v1(47.24,25.58) 45.59,25.58 45.04,26.13 TL074#5.3 ; v1(58.81,26.52) 58.81,27.35 ; 77.24,34.55 75.97,34.55 75.97,37.18 76.84,38.04 76.84,63.04 75.82,64.06 75.82,76.96 1K#6.2
+12: length 23.5
  Top Layer w0.254: v1(27.56,38.66) v1(29.46,38.66) ; v1(16,32.94) v1(16,37.52) ; v1(67.18,31.04) v1(67.18,34.59) ; v1(52.45,31.04) v1(52.45,34.59) ; v1(37.47,30.91) v1(37.47,34.59) ; U1.2 U1.1 ; v1(22.48,30.91) v1(22.48,34.59)
-12: length 206.3
  Top Layer w0.254: v1(45.21,32.17) 45.21,25.2 46.61,23.81 v1(46.61,11.47) 46.61,10.08 U1.10 U1.9 30.86,1.57 100NF#2.1 ; v1(80.9,11.48) v1(77.34,11.48)
  Bottom Layer w0.254: 73.43,34.55 73.43,32.18 58.6,32.18 ; 28.97,32.17 28.98,32.18 28.98,32.94 ; 28.97,32.17 43.78,32.17 ; 28.97,32.17 28.96,32.18 14.1,32.18 14.1,32.94 ; TL074#5.11 43.77,32.18 43.78,32.17 ; 58.6,32.18 46.94,32.18 ; 58.6,32.18 58.62,32.2 58.62,34.55 ; 46.94,32.18 46.1,32.18 ; 46.94,32.18 46.93,32.17 v1(45.21,32.17) 43.78,32.17 ; 14.1,32.94 14.1,34.49 TL074#4.11 ; 14.1,32.94 14.12,32.97 ; 28.98,32.94 28.97,32.94 28.98,32.95 ; 28.98,32.94 28.98,32.95 ; 29.77,11.48 14.91,11.48 7K#10.2 ; 29.77,11.48 7K#8.2 ; 29.77,11.48 44.5,11.48 ; v1(80.9,11.48) 84.26,11.48 7K.2 ; 59.62,11.48 74.3,11.48 ; 59.62,11.48 7K#4.2 ; 59.62,11.48 44.5,11.48 ; 74.3,11.48 v1(77.34,11.48) ; 74.3,11.48 7K#2.2 ; 28.98,32.95 TL074#3.11 ; 44.5,11.48 7K#6.2

## Copper pours and planes (outline as drawn; the poured copper is in the pictures)
GND on Top Layer: 0,100 91.44,100 91.44,0 0,0
+12 on Bottom Layer: 0,100 91.44,100 91.44,0 0,0

## Text on the board
Bottom Silkscreen Layer: Red Line

# Board fader_panel
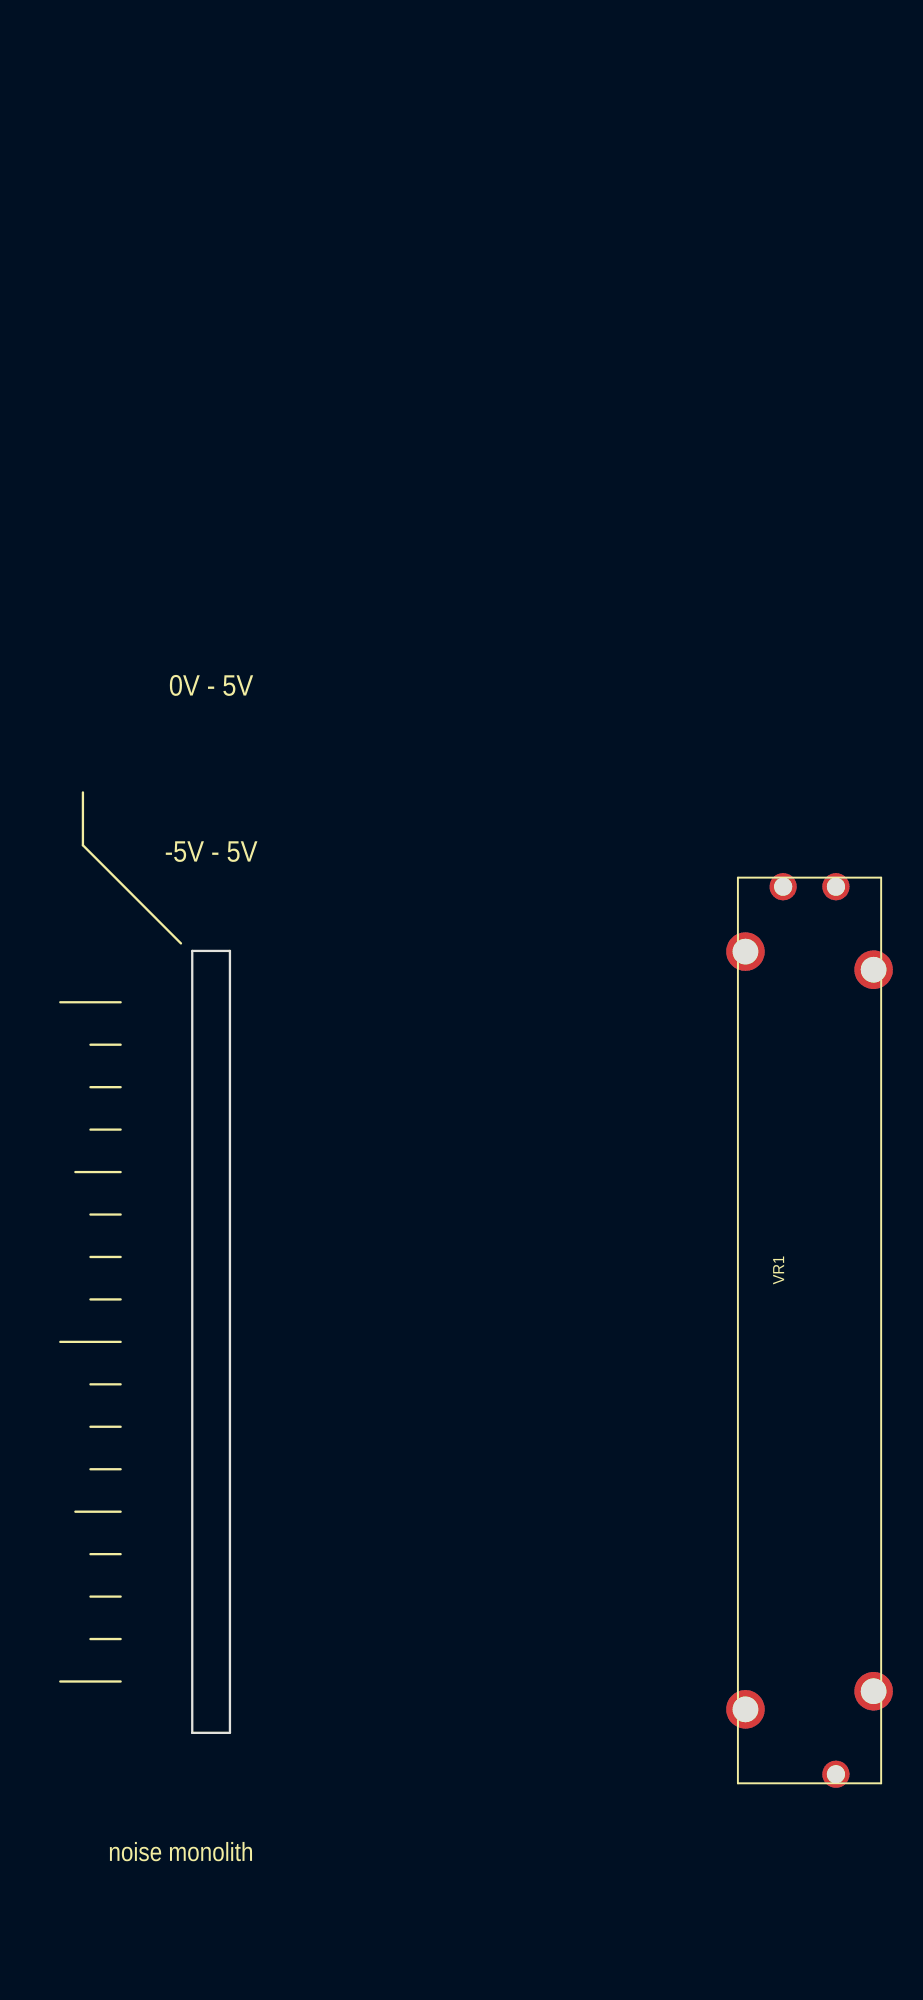
[diagram p4: board, top side]
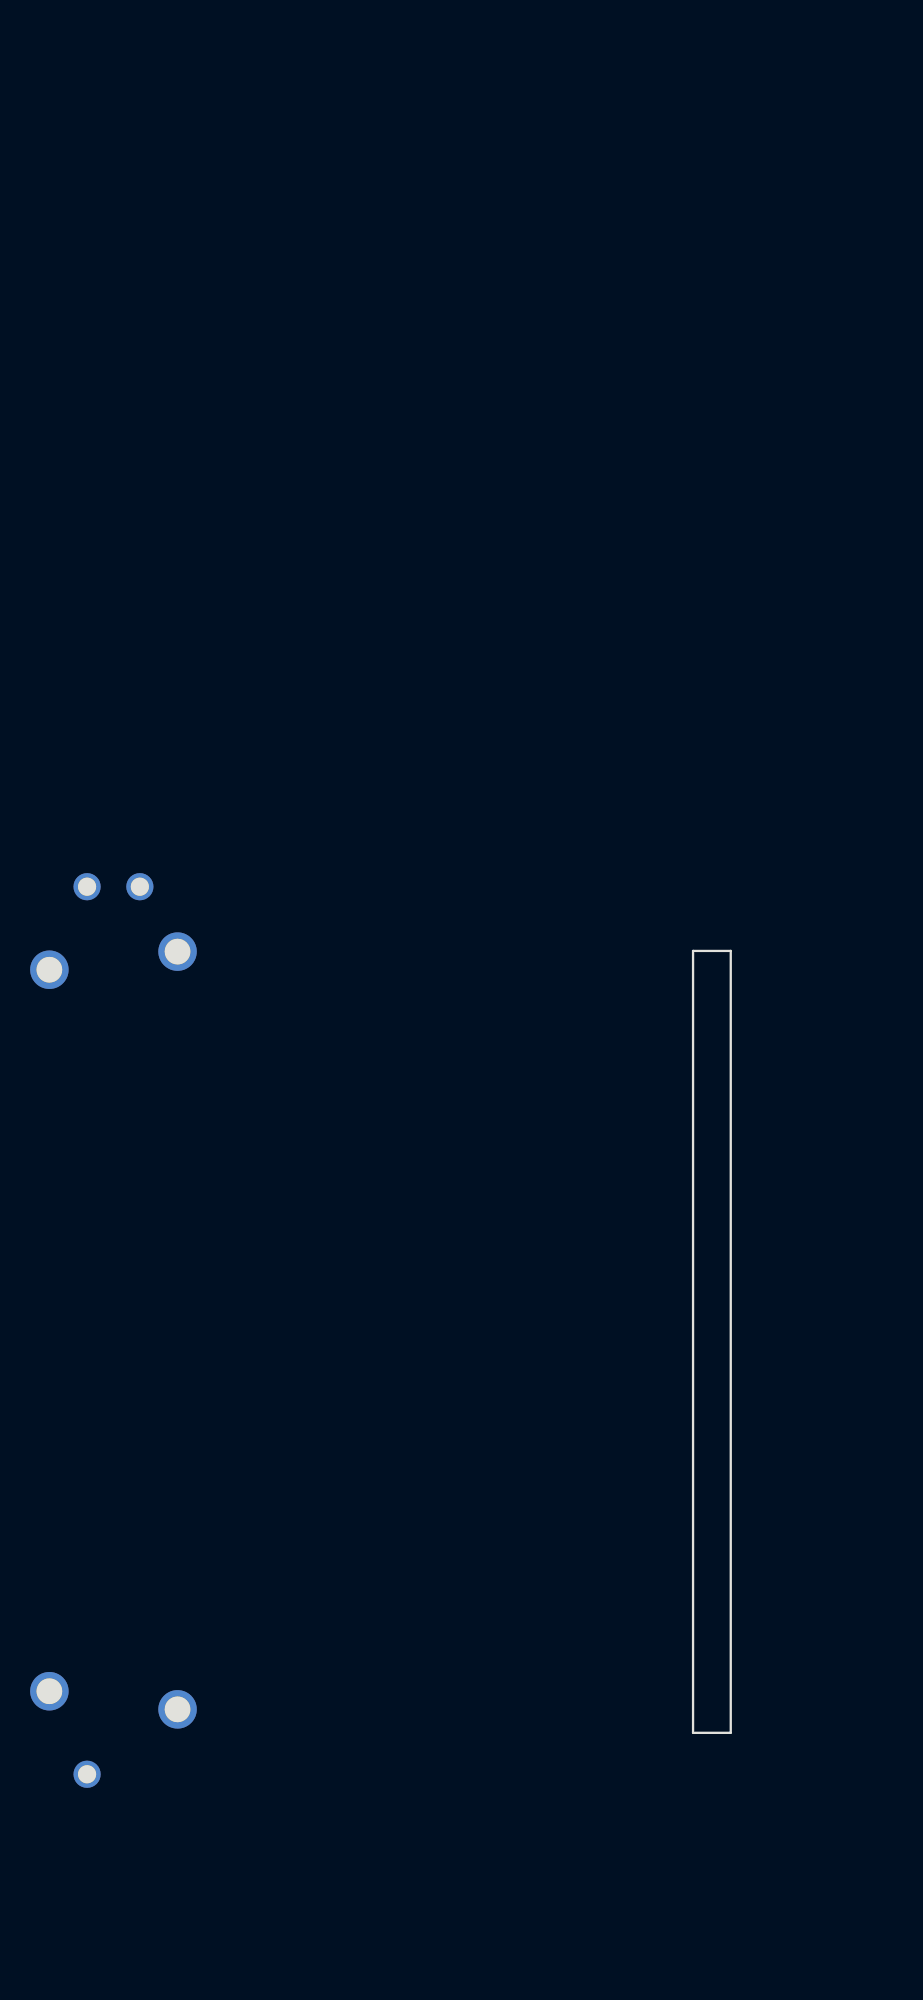
[diagram p5: board, bottom side, seen from below]

Outline 20 x 128.5 mm; copper layers: Top Layer, Bottom Layer. Coordinates in mm from the lower left corner of the outline.
Outline path: 0,128.5 0,0 20,0 20,128.5 0,128.5 ; 10.75,67.5 13.25,67.5 13.25,15.7 10.75,15.7 10.75,67.5
Stack: Top Layer 0.035mm / Dielectric1 1.51mm FR4 er 4.5 / Bottom Layer 0.035mm

## Design rules (mm)
spacing safeClearance (default): track to track 0.127, other pairs 0 to 0.2
track width trackWidth (default): min 0.003, default 0.003, max 2.54
differential pair differentialPair (default): width min 0.127, default 0.254, max 2.54; gap min 0.152, default 0.152
via viaSize (default): diameter min 0, default 0, max 2.6; hole min 0, default 0, max 2

## Placement (name value [footprint] x y rotation side)
VR1  -  [F4505-N0SC2B10K]  51.69 71.75 270 top

## Footprints (pads in the part's own frame, mm; a bottom-side part is the same pattern mirrored in y, then rotated)
F4505-N0SC2B10K
  round 1.8 hole 1.2: 1(0,1.75) 2(0,-1.75) 3(58.8,1.75)
  round 2.55 hole 1.7: MH1(5.5,4.25) MH2(4.3,-4.25) MH3(53.3,4.25) MH4(54.5,-4.25)

## Nets
FADER_1: VR1.2
N$1: VR1.1
N$2: VR1.3

Pads without a net: VR1 MH1 MH2 MH3 MH4

## Text on the board
Top Silkscreen Layer: noise monolith | 0V - 5V | -5V - 5V

# Board PCB4
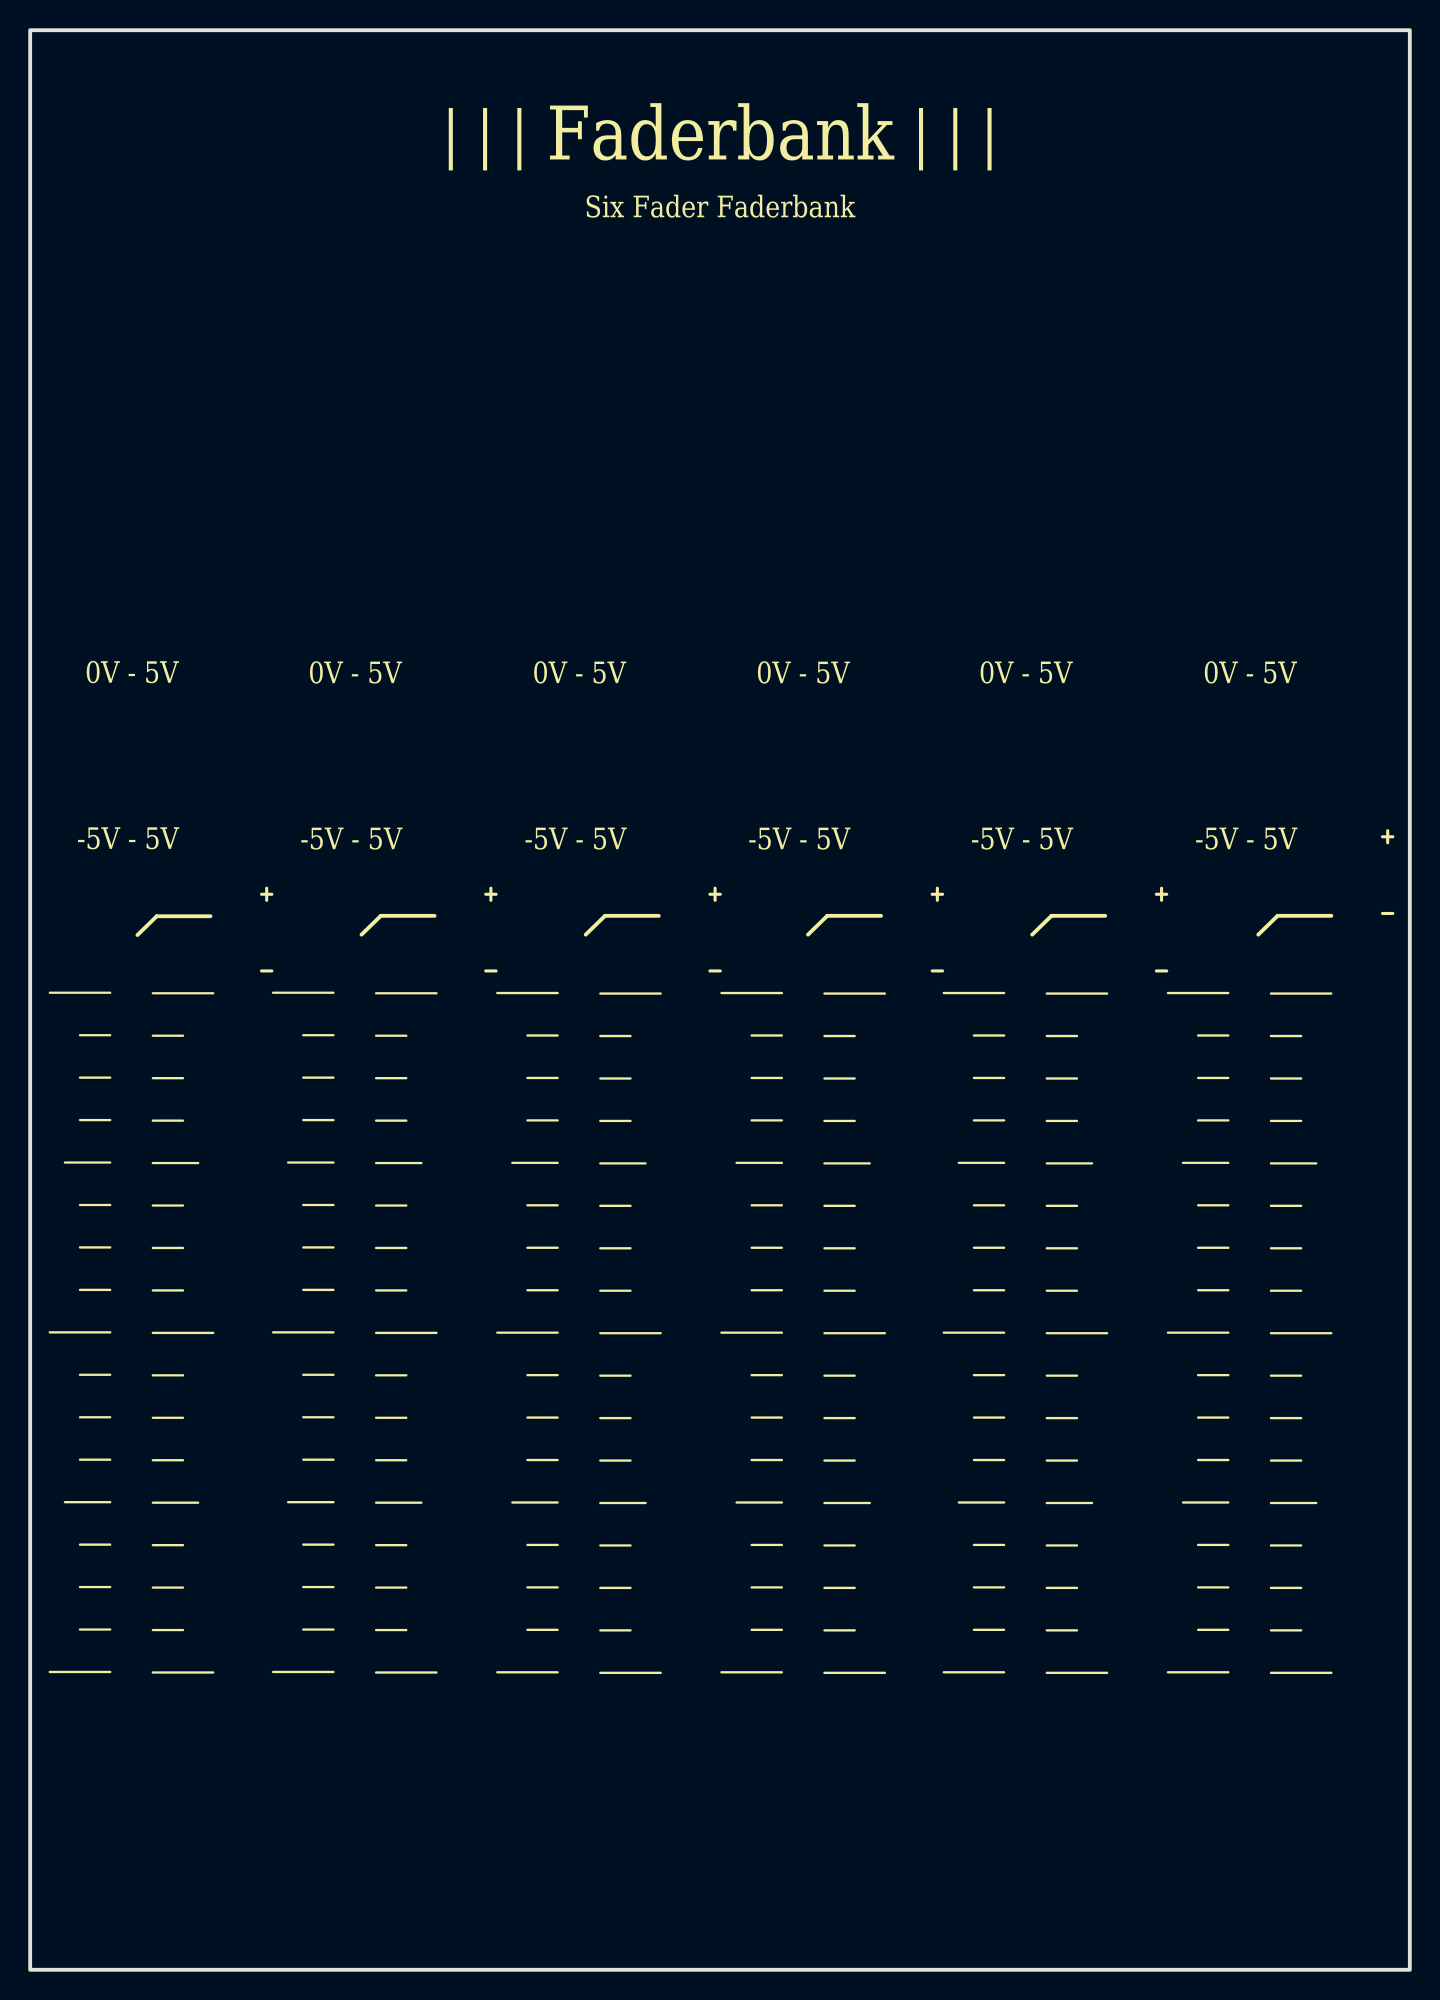
[diagram p6: board, top side]
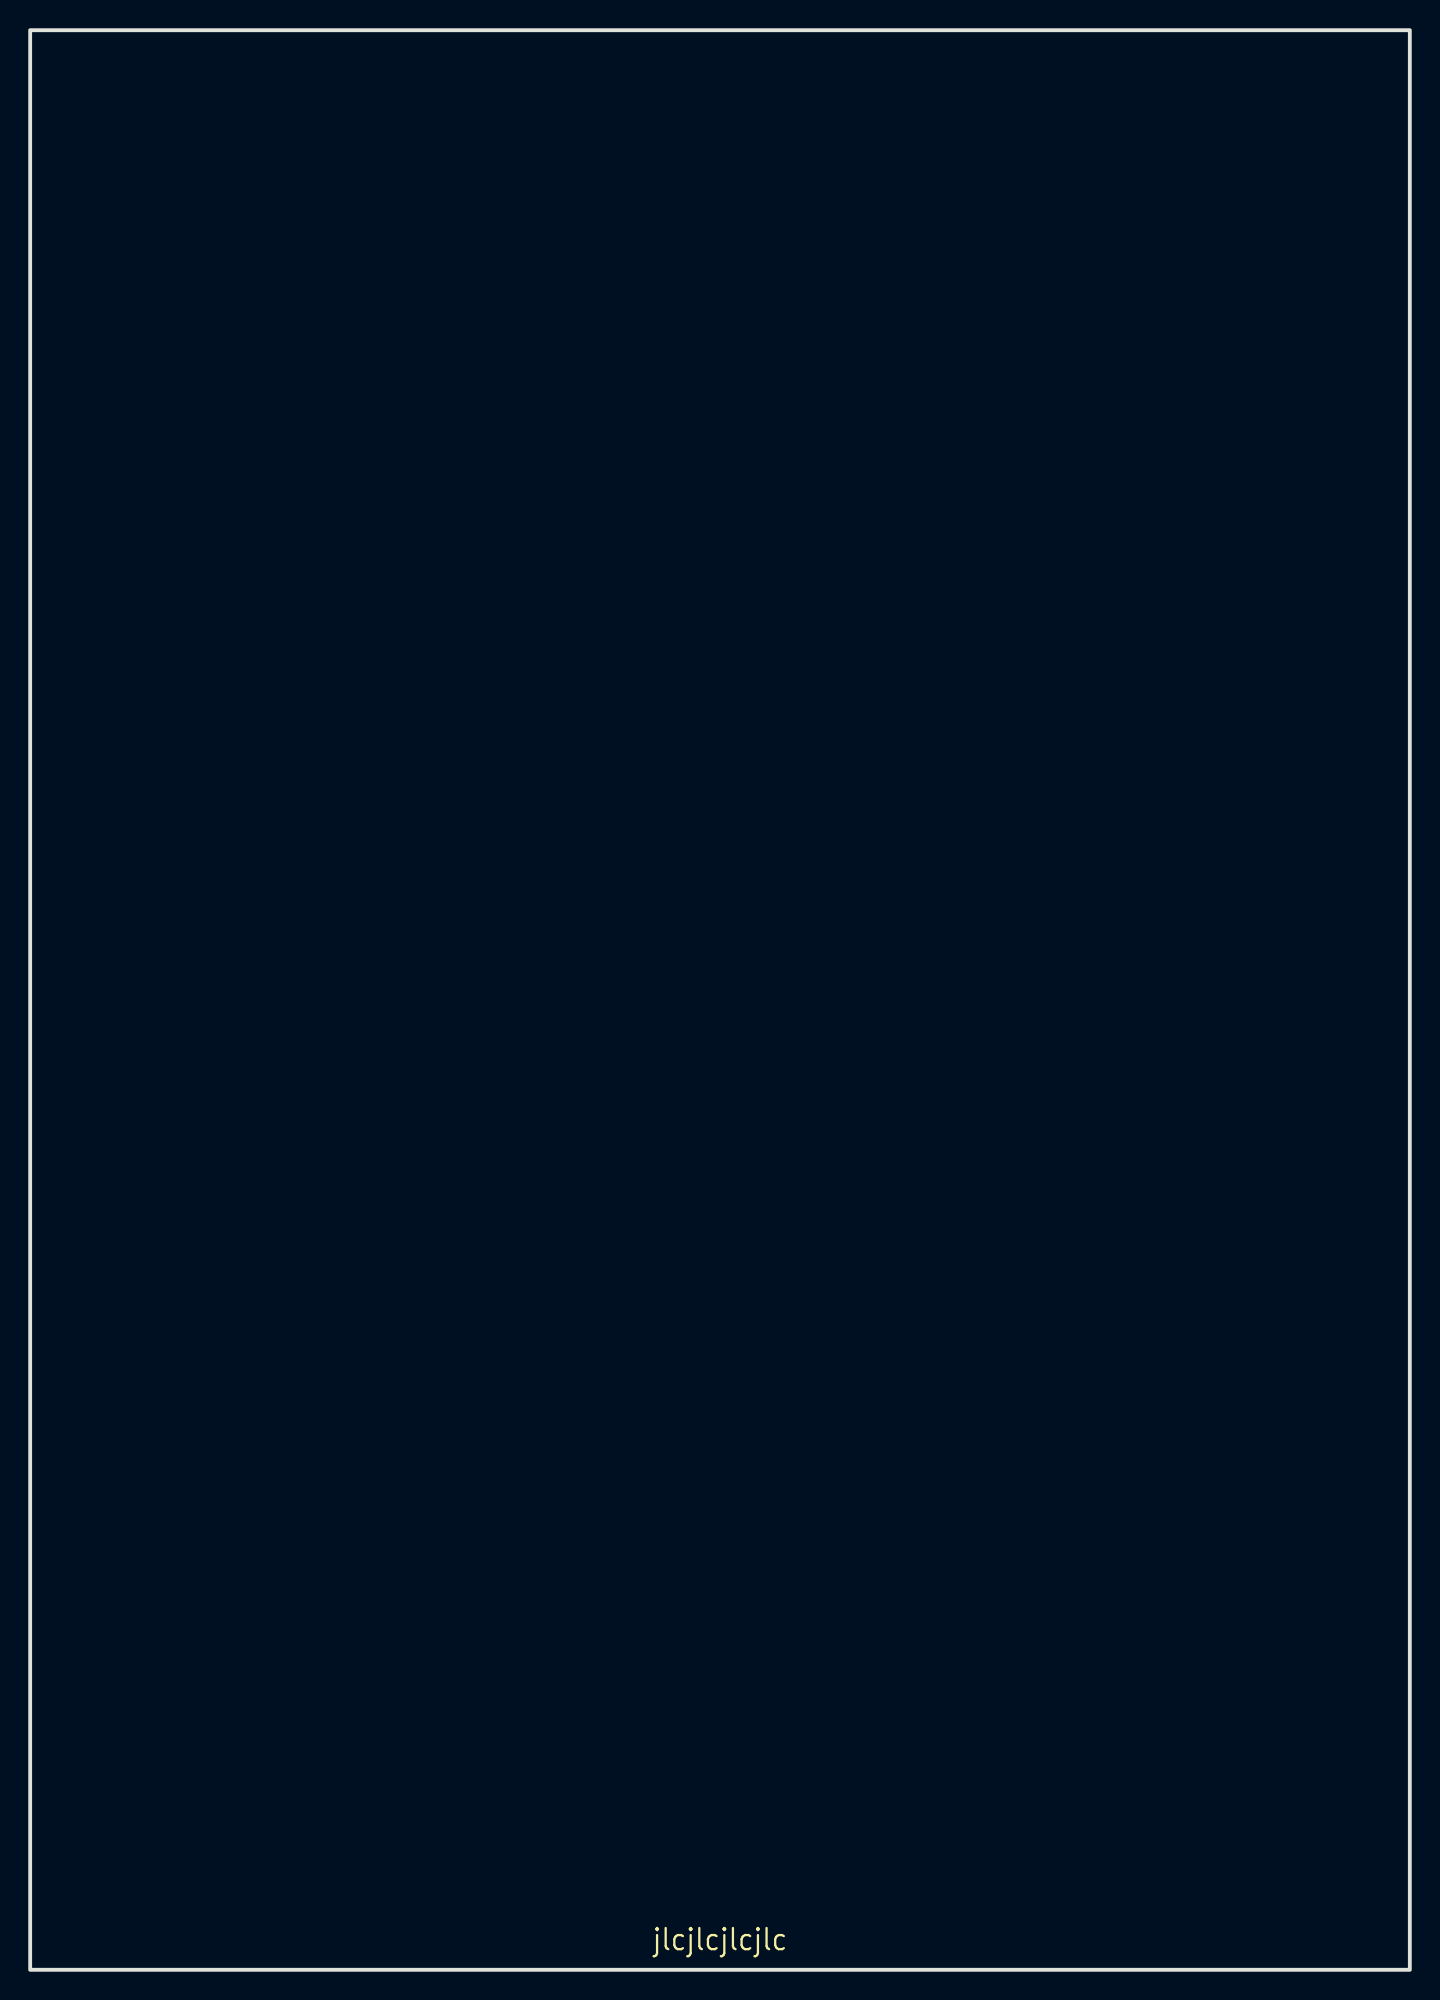
[diagram p7: board, bottom side, seen from below]

Outline 91.44 x 128.5 mm; copper layers: Top Layer, Bottom Layer. Coordinates in mm from the lower left corner of the outline.
Outline path: rectangle 0,128.5 91.44,0
Stack: Top Layer 0.035mm / Dielectric1 1.51mm FR4 er 4.5 / Bottom Layer 0.035mm

## Design rules (mm)
template: JLCPCB Capability(Two Layers Board)
spacing copperThickness1oz (default): track to track 0.102, other pairs 0.152 to 0.3
spacing copperThickness2oz: track to track 0.203, other pairs 0.152 to 0.3
track width copperThickness1oz (default): min 0.127, default 0.254, max 2.54
track width copperThickness2oz: min 0.203, default 0.254, max 2.54
differential pair differentialPair (default): width min 0.127, default 0.254, max 2.54; gap min 0.152, default 0.152
via viaSize (default): diameter min 0.5, default 0.61, max 10; hole min 0.3, default 0.305, max 6.3

## Placement (name value [footprint] x y rotation side)

## Nets

## Text on the board
Bottom Silkscreen Layer: jlcjlcjlcjlc
Top Silkscreen Layer: + | - | -5V - 5V | 0V - 5V | Six Fader Faderbank | | | | Faderbank | | |
